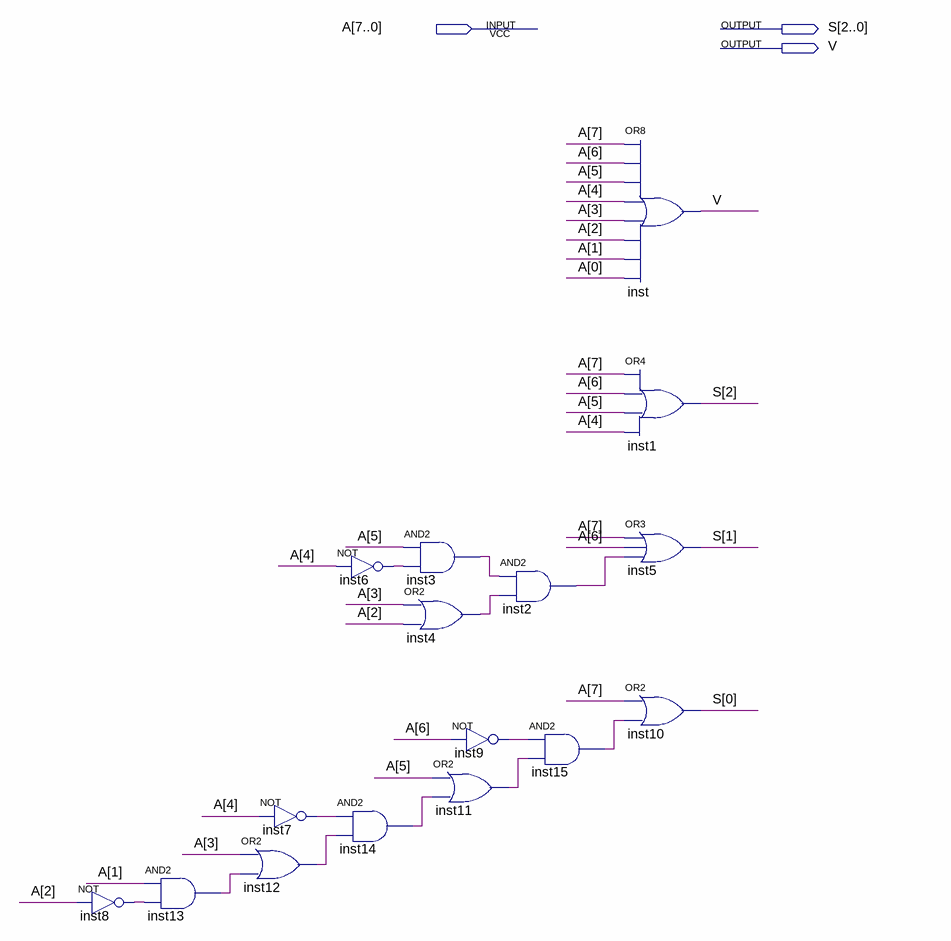
[diagram p0: schematic sheet]
// Quartus schematic encod.bdf as structural Verilog: 16 symbols, 3 pins
module encod (
  input  [7:0] A,
  output [2:0] S,
  output V
);

  wire inst2_out, inst3_out, inst4_out, inst6_out, inst7_out, inst8_out, inst9_out, inst11_out, inst12_out,
       inst13_out, inst14_out, inst15_out;

  not inst8 (inst8_out, A[2]);
  and inst13 (inst13_out, A[1], inst8_out);
  not inst7 (inst7_out, A[4]);
  or inst12 (inst12_out, A[3], inst13_out);
  not inst6 (inst6_out, A[4]);
  and inst14 (inst14_out, inst7_out, inst12_out);
  and inst3 (inst3_out, A[5], inst6_out);
  or inst4 (inst4_out, A[3], A[2]);
  not inst9 (inst9_out, A[6]);
  or inst11 (inst11_out, A[5], inst14_out);
  and inst2 (inst2_out, inst3_out, inst4_out);
  and inst15 (inst15_out, inst9_out, inst11_out);
  or inst (V, A[7], A[6], A[5], A[4], A[3], A[2], A[1], A[0]);
  or inst1 (S[2], A[7], A[6], A[5], A[4]);
  or inst5 (S[1], A[7], A[6], inst2_out);
  or inst10 (S[0], A[7], inst15_out);
endmodule
